# EAGLE design IRRemote (EAGLE 7.3.0)
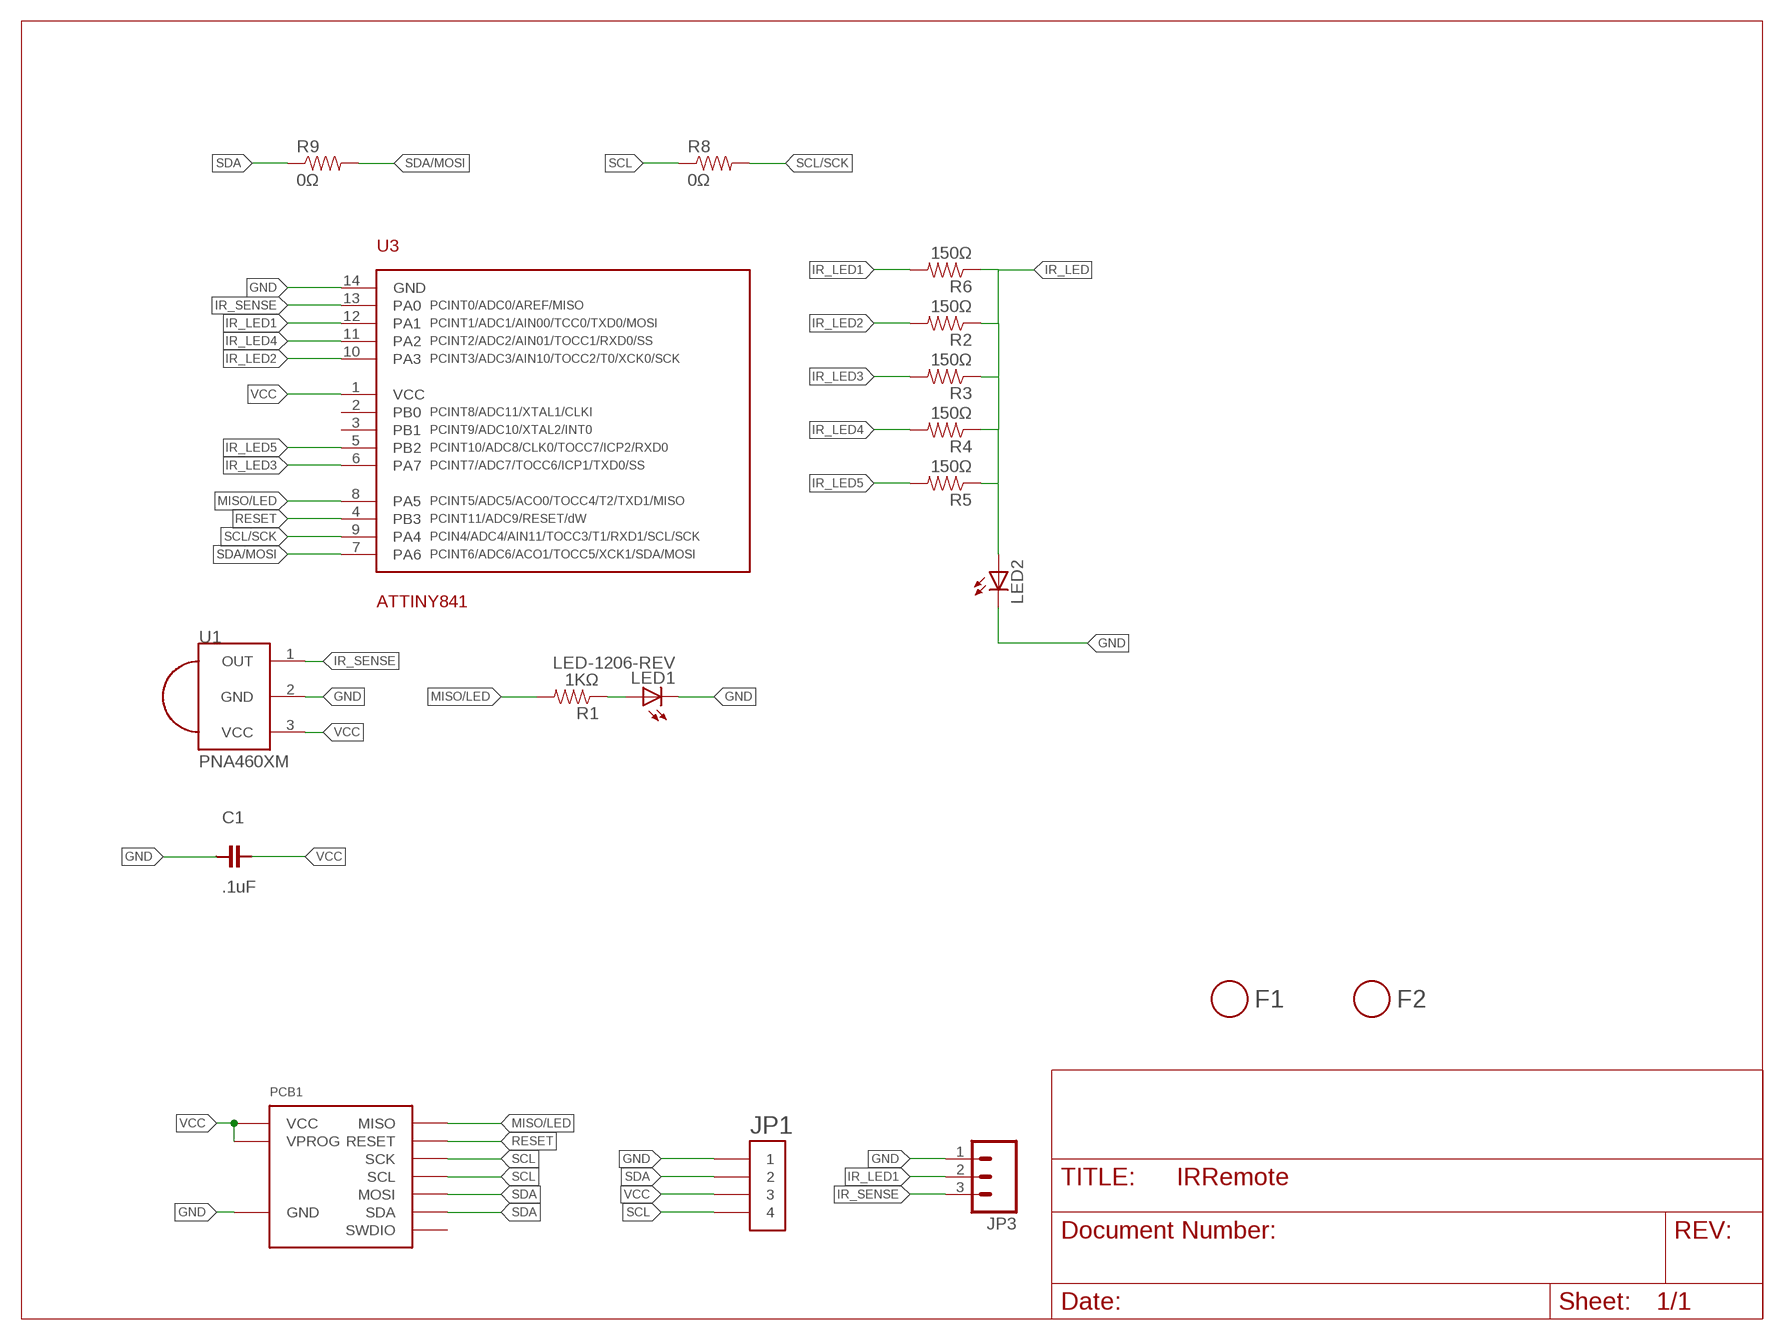
[diagram p0: schematic, sheet 1]
FRAME1 (LETTER_L): BOM: EXCLUDE

## Parts
C1  .1uF  CAPACITOR-.1UF  [0603]
F1  FIDUCIAL  [FIDUCIAL_1MM]
F2  FIDUCIAL  [FIDUCIAL_1MM]
JP1  HEADER-1X4-AMPMODU  [AMPMODU-4P]
JP3  M03PTH  [1X03]
LED1  LED-1206-REV  [LED-1206-REV]
LED2  LED5MM  [LED5MM]
PCB1  DEVICE-PCB  [DEVICE-PCB]
R1  1KΩ  RESISTOR-1KΩ  [0603]
R2  150Ω  RESISTOR-150Ω  [0603]
R3  150Ω  RESISTOR-150Ω  [0603]
R4  150Ω  RESISTOR-150Ω  [0603]
R5  150Ω  RESISTOR-150Ω  [0603]
R6  150Ω  RESISTOR-150Ω  [0603]
R8  0Ω  RESISTOR-0Ω  [0603]
R9  0Ω  RESISTOR-0Ω  [0603]
U1  PNA460XM  [PNA460XM]
U3  ATTINY841  [SOIC-14]

## Nets
GND: C1.2 JP1.P$1 JP1.P$2 JP3.1 LED1.C LED2.K(C) PCB1.GND U1.2(GND) U3.14(GND)
IR_LED: LED2.A R2.1 R3.1 R4.1 R5.1 R6.1
IR_LED1: JP3.2 R6.2 U3.12(PA1)
IR_LED2: R2.2 U3.10(PA3)
IR_LED3: R3.2 U3.6(PA7)
IR_LED4: R4.2 U3.11(PA2)
IR_LED5: R5.2 U3.5(PB2)
IR_SENSE: JP3.3 U1.1(OUT) U3.13(PA0)
MISO/LED: PCB1.MISO R1.2 U3.8(PA5)
N$7: LED1.A R1.1
RESET: PCB1.RESET U3.4(PB3)
SCL: JP1.P$7 JP1.P$8 PCB1.CLK(SCK) PCB1.SCL R8.1
SCL/SCK: R8.2 U3.9(PA4)
SDA: JP1.P$3 JP1.P$4 PCB1.MOSI PCB1.SDA R9.1
SDA/MOSI: R9.2 U3.7(PA6)
VCC: C1.1 JP1.P$5 JP1.P$6 PCB1.VCC PCB1.VPROG U1.3(VCC) U3.1(VCC)
Unconnected: PCB1.SWDIO U3.2(PB0) U3.3(PB1)

## Library data of the parts
C1 = Modulo:CAPACITOR: Capacitor; PARTNUM: C0603C104K5RACTU
F1 F2 = Modulo:FIDUCIAL; BOM: EXCLUDE
JP1 = Modulo:HEADER-1X4; PARTNUM: 147721-3
JP3 = SparkFun-Connectors:M03: Header 3 Standard 3-pin 0.1" header. Use with straight break away headers (SKU : PRT-00116), right angle break away headers (PRT-00553), swiss pins (PRT-00743), machine pins (PRT-00117), and female headers (PRT-00115). Molex polarized connector foot print use with SKU : PRT-08232 with associated crimp pins and housings.; BOM: EXCLUDE
LED1 = Modulo:LED: LED; PARTNUM: LTST-C230TBKT
LED2 = SparkFun-LED:LED: LEDs Standard schematic elements and footprints for 5mm, 3mm, 1206, and 0603 sized LEDs. 5mm - Spark Fun Electronics SKU : COM-00529 (and others); PARTNUM: IR928-6C-F
PCB1 = Modulo:DEVICE-PCB: Modulo Footprint; PARTNUM: IRRemote PCB
R1 = Modulo:RESISTOR: Resistor Basic schematic elements and footprints for 0603, 1206, and PTH resistors.; PARTNUM: ERJ-3EKF1001V
R2-R6 = Modulo:RESISTOR: Resistor Basic schematic elements and footprints for 0603, 1206, and PTH resistors.; PARTNUM: ERJ-3EKF1500V
R8 R9 = Modulo:RESISTOR: Resistor Basic schematic elements and footprints for 0603, 1206, and PTH resistors.; BOM: EXCLUDE; PARTNUM: ERJ-3GEY0R00V
U1 = adafruit:PNA460XM: IR 38KHz receiver PNA4602 and related receivers http://www.ladyada.net/library/pcb/eaglelibrary.html; PARTNUM: TSOP38338
U3 = Modulo:ATTINY841; PARTNUM: ATTINY841-SSUR

## Board
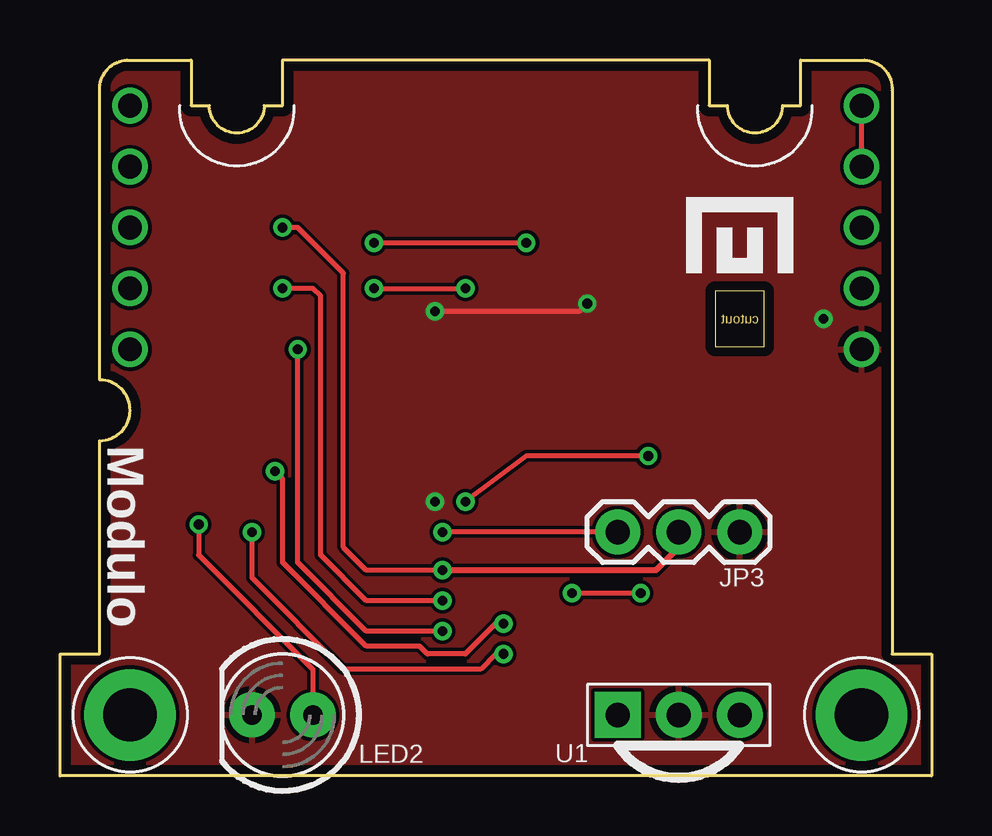
[diagram p1: board, top side]
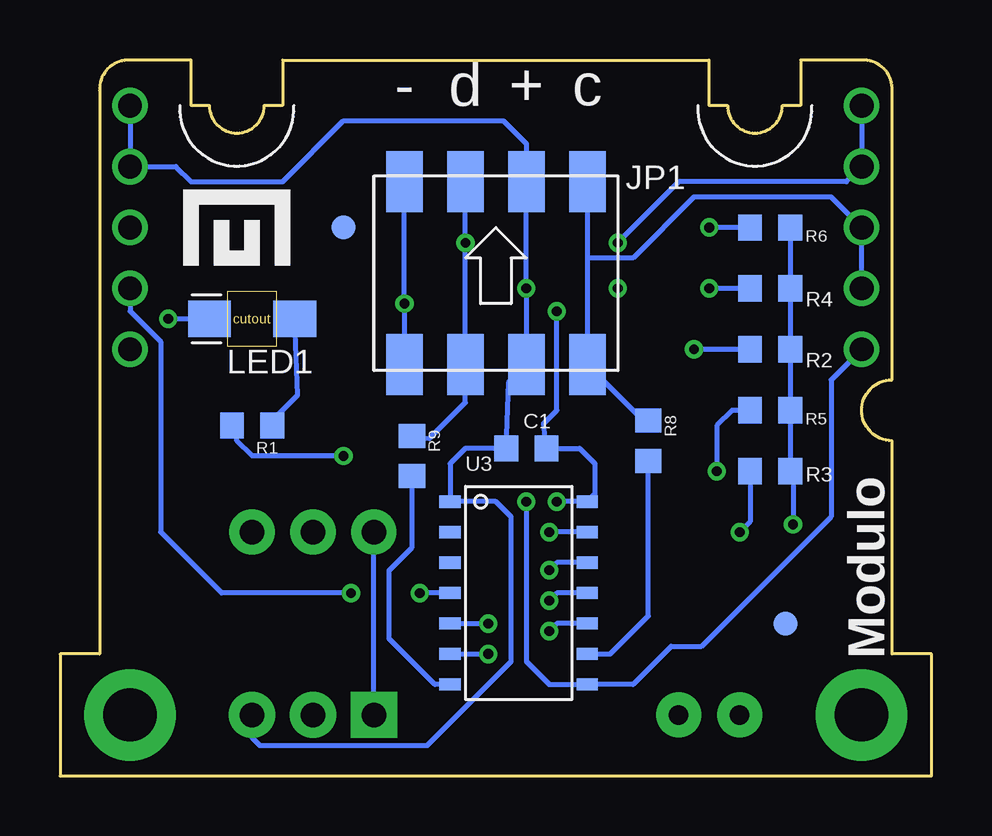
[diagram p2: board, bottom side, seen from below]

Size 36.32 x 29.84 mm. Coordinates in mm from the lower left corner, seen from the top.
Copper layers (1*16): Top 0.0356mm / dielectric 1.5011mm / Bottom 0.0356mm
Design rules "Modulo": minimum track width 6mil, minimum drill 13mil, track to track 6mil, track to pad 6mil, pad to pad 6mil, via to via 6mil, smd to smd 6mil, copper to edge 15mil, drill to drill 6mil, minimum pad ring 7mil, minimum via ring 7mil, stop-mask expansion 3mil, vias tented up to drill 25mil, thermal gap 10mil

### Footprints (pad centres in the part's own frame; a part is rotated, then mirrored left to right if it is on the bottom)
0603 = smd 0.991 x 1.092: 1 -0.838,0; 2 0.838,0
FIDUCIAL_1MM = smd 1 x 1: 1 0,0
AMPMODU-4P = smd 1.524 x 2.54: P$1 -3.81,3.81; P$2 -3.81,-3.81; P$3 -1.27,3.81; P$4 -1.27,-3.81; P$5 1.27,3.81; P$6 1.27,-3.81; P$7 3.81,3.81; P$8 3.81,-3.81
1X03 = drill 1.016 pad 1.88: 1 0,0; 2 2.54,0; 3 5.08,0
LED-1206-REV = smd 1.778 x 1.524: A -1.778,0; C 1.778,0
LED5MM = drill 0.813 pad 1.88: A -1.27,0; K 1.27,0
DEVICE-PCB = drill 0.991: CLK 2.54,20.32; GND 33.02,17.78; MISO 2.54,17.78; MOSI 2.54,25.4; RESET 33.02,20.32; SCL 2.54,22.86; SDA 2.54,27.94; SWDIO 33.02,22.86; VCC 33.02,25.4; VPROG 33.02,27.94 | drill 2.223 pad 3.81: P$1 2.54,2.54; P$2 33.02,2.54
PNA460XM = drill 1.016 pad 1.93 square: 1 -2.54,0 | drill 1.016 pad 1.93: 2 0,0; 3 2.54,0
SOIC-14 = smd 0.508 x 0.889: 1 0,-3.175; 2 1.27,-3.175; 3 2.54,-3.175; 4 3.81,-3.175; 5 5.08,-3.175; 6 6.35,-3.175; 7 7.62,-3.175; 8 7.62,2.54; 9 6.35,2.54; 10 5.08,2.54; 11 3.81,2.54; 12 2.54,2.54; 13 1.27,2.54; 14 0,2.54

### Placement (x,y rotation side)
C1  16.89,13.65 0 bottom
F1  6.1,6.35 0 bottom
F2  24.51,22.86 0 bottom
JP1  18.16,20.95 0 bottom
JP3  28.32,10.16 180 top
LED1  28.32,19.05 180 bottom
LED2  9.27,2.54 180 top
PCB1  0.38,0 0 top
R1  28.32,14.61 180 bottom
R2  6.73,17.78 180 bottom
R3  6.73,12.7 180 bottom
R4  6.73,20.32 180 bottom
R5  6.73,15.24 180 bottom
R6  6.73,22.86 180 bottom
R8  11.81,13.97 270 bottom
R9  21.65,13.34 270 bottom
U1  25.78,2.54 0 top
U3  16.89,11.43 270 bottom
U$1  [LOGO-SMALL]  28,21.59 0 top
U$2  [LOGO-SMALL]  29.27,21.91 0 bottom

### Tracks (layer width: path | path; a pad name or v marks a point on that pad's centre or on a via)
GND  (via drill 0.41)
  Top 0.203: v15.62,19.37 21.65,19.37 v21.97,19.68
  Bottom 0.203: LED1.C v31.81,19.05 | v15.62,11.43 U3.14 14.03,11.75 14.03,13.02 14.67,13.65 C1.2 16.17,14.7 15.62,15.24 v15.62,19.37 | JP1.P$2 v21.97,19.68 JP1.P$1
  pour Top: 35.94,0 0.38,0 0.38,30.48 35.94,30.48
IR_LED  (via drill 0.41)
  Top 0.203: v5.78,10.48 5.78,9.21 10.54,4.45 LED2.A
  Bottom 0.203: R6.1 R4.1 R2.1 R5.1 R3.1 5.78,12.7 v5.78,10.48
IR_LED1  (via drill 0.41)
  Top 0.203: v15.94,8.57 12.76,8.57 11.81,9.53 11.81,20.95 9.91,22.86 v9.27,22.86
  Top 0.254: JP3.2 25.78,9.53 24.83,8.57 v15.94,8.57
  Bottom 0.203: U3.12 15.62,8.89 v15.94,8.57 | R6.2 v9.27,22.86
IR_LED2  (via drill 0.41)
  Top 0.203: v15.94,6.03 12.76,6.03 9.91,8.89 v9.91,17.78
  Bottom 0.203: U3.10 15.62,6.35 v15.94,6.03 | R2.2 v9.91,17.78
IR_LED3  (via drill 0.41)
  Top 0.203: v18.48,5.08 18.16,5.08 17.53,4.45 11.81,4.45 8,8.26 v8,10.16
  Bottom 0.203: U3.6 v18.48,5.08 | R3.2 7.57,10.59 v8,10.16
IR_LED4  (via drill 0.41)
  Top 0.203: v15.94,7.3 12.76,7.3 10.86,9.21 10.86,20 10.54,20.32 v9.27,20.32
  Bottom 0.203: U3.11 15.62,7.62 v15.94,7.3 | R4.2 v9.27,20.32
IR_LED5  (via drill 0.41)
  Top 0.203: v18.48,6.35 18.16,6.35 16.89,5.08 15.3,5.08 14.99,5.4 12.76,5.4 9.27,8.89 9.27,12.38 v8.95,12.7
  Bottom 0.203: U3.5 v18.48,6.35 | R5.2 8.32,15.24 8.95,14.61 v8.95,12.7
IR_SENSE  (via drill 0.41)
  Top 0.203: JP3.3 v15.94,10.16
  Bottom 0.203: U1.1 JP3.3 | U3.13 v15.94,10.16
MISO/LED  (via drill 0.41)
  Top 0.203: v24.51,13.34 19.43,13.34 v16.89,11.43
  Bottom 0.203: v16.89,11.43 16.89,4.76 15.94,3.81 U3.8 12.45,3.81 10.86,5.4 9.59,5.4 4.19,10.79 4.19,16.51 PCB1.MISO | v24.51,13.34 28.32,13.34 28.96,13.97 28.96,14.4 R1.2
N$7
  Bottom 0.203: R1.1 27.48,14.81 26.42,15.88 LED1.A
RESET  (via drill 0.41)
  Top 0.203: v21.34,7.62 v24.19,7.62
  Bottom 0.203: U3.4 v21.34,7.62 | v24.19,7.62 29.59,7.62 32.13,10.16 32.13,18.1 33.4,19.37 PCB1.RESET
SCL
  Bottom 0.203: R8.1 12.13,14.92 JP1.P$8 14.35,21.59 | JP1.P$7 14.35,21.59 | 14.35,21.59 12.45,21.59 9.91,24.13 4.19,24.13 PCB1.SCL PCB1.CLK
SCL/SCK
  Bottom 0.203: U3.9 13.4,5.08 11.81,6.67 R8.2
SDA  (via drill 0.41)
  Top 0.203: v13.08,22.23 v19.43,22.23
  Bottom 0.203: R9.1 20.93,14.06 19.43,15.56 JP1.P$4 v19.43,22.23 JP1.P$3 | PCB1.SDA PCB1.MOSI 3.56,24.77 10.54,24.77 v13.08,22.23
SDA/MOSI
  Bottom 0.203: U3.7 20.7,3.81 22.61,5.71 22.61,8.57 21.65,9.53 R9.2
VCC  (via drill 0.41)
  Top 0.203: PCB1.VCC PCB1.VPROG | v13.08,20.32 v16.89,20.32
  Bottom 0.203: U1.3 28.32,1.59 28,1.27 21.02,1.27 17.53,4.76 17.53,10.79 18.16,11.43 U3.1 20.07,13.02 19.43,13.65 C1.1 17.62,16.42 JP1.P$6 v16.89,20.32 JP1.P$5 16.89,26.35 17.84,27.3 24.51,27.3 27.05,24.77 30.86,24.77 31.5,25.4 PCB1.VCC PCB1.VPROG